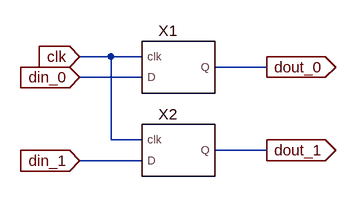
[diagram p0: schematic sram_16x2_data_dff.asc]
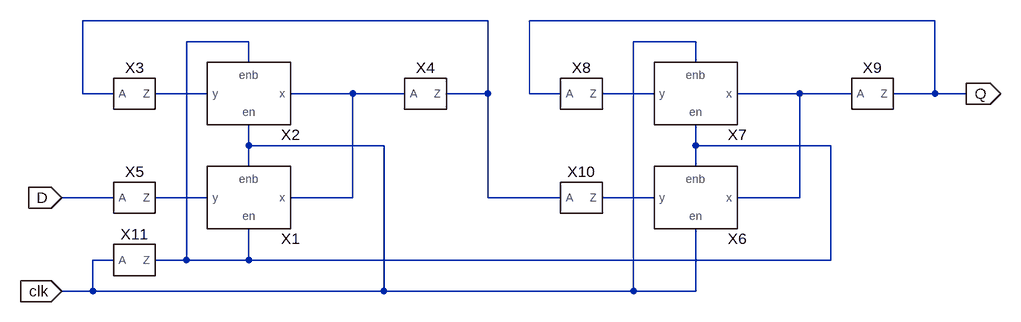
[diagram p1: sub-circuit dff.asc]
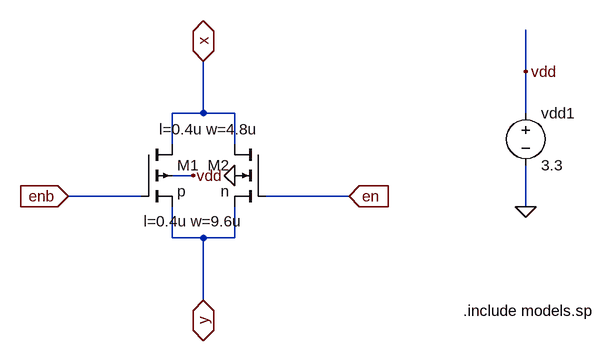
[diagram p2: sub-circuit tri_gate.asc]
sram_16x2_data_dff.asc, the LTspice schematic file:
Version 4
SHEET 1 880 680
WIRE 80 80 32 80
WIRE 128 80 80 80
WIRE 320 96 240 96
WIRE 128 112 32 112
WIRE 80 208 80 80
WIRE 128 208 80 208
WIRE 320 224 240 224
WIRE 128 240 32 240
FLAG 32 112 din_0
IOPIN 32 112 In
FLAG 32 240 din_1
IOPIN 32 240 In
FLAG 320 96 dout_0
IOPIN 320 96 Out
FLAG 320 224 dout_1
IOPIN 320 224 Out
FLAG 32 80 clk
IOPIN 32 80 In
SYMBOL dff 160 112 R0
SYMATTR InstName X1
SYMBOL dff 160 240 R0
SYMATTR InstName X2

dff.asc, the sub-circuit schematic file:
Version 4
SHEET 1 1748 1736
WIRE 16 -160 -608 -160
WIRE 704 -160 80 -160
WIRE -352 -128 -448 -128
WIRE 336 -128 240 -128
WIRE -352 -96 -352 -128
WIRE 336 -96 336 -128
WIRE -608 -48 -608 -160
WIRE -560 -48 -608 -48
WIRE -416 -48 -496 -48
WIRE -192 -48 -288 -48
WIRE -112 -48 -192 -48
WIRE 16 -48 16 -160
WIRE 16 -48 -48 -48
WIRE 80 -48 80 -160
WIRE 128 -48 80 -48
WIRE 272 -48 192 -48
WIRE 496 -48 400 -48
WIRE 576 -48 496 -48
WIRE 704 -48 704 -160
WIRE 704 -48 640 -48
WIRE 752 -48 704 -48
WIRE -352 32 -352 0
WIRE -144 32 -352 32
WIRE 336 32 336 0
WIRE 544 32 336 32
WIRE -352 64 -352 32
WIRE 336 64 336 32
WIRE -560 112 -640 112
WIRE -416 112 -496 112
WIRE -192 112 -192 -48
WIRE -192 112 -288 112
WIRE 16 112 16 -48
WIRE 128 112 16 112
WIRE 272 112 192 112
WIRE 496 112 496 -48
WIRE 496 112 400 112
WIRE -560 208 -592 208
WIRE -448 208 -448 -128
WIRE -448 208 -496 208
WIRE -352 208 -352 160
WIRE -352 208 -448 208
WIRE 544 208 544 32
WIRE 544 208 -352 208
WIRE -592 256 -592 208
WIRE -592 256 -640 256
WIRE -144 256 -144 32
WIRE -144 256 -592 256
WIRE 240 256 240 -128
WIRE 240 256 -144 256
WIRE 336 256 336 160
WIRE 336 256 240 256
FLAG -640 256 clk
IOPIN -640 256 In
FLAG -640 112 D
IOPIN -640 112 In
FLAG 752 -48 Q
IOPIN 752 -48 Out
SYMBOL tri_gate -352 112 R180
SYMATTR InstName X1
SYMBOL tri_gate -352 -48 R180
SYMATTR InstName X2
SYMBOL inv -528 -48 R0
SYMATTR InstName X3
SYMBOL inv -80 -48 R0
SYMATTR InstName X4
SYMBOL inv -528 112 R0
SYMATTR InstName X5
SYMBOL tri_gate 336 112 R180
SYMATTR InstName X6
SYMBOL tri_gate 336 -48 R180
SYMATTR InstName X7
SYMBOL inv 160 -48 R0
SYMATTR InstName X8
SYMBOL inv 608 -48 R0
SYMATTR InstName X9
SYMBOL inv 160 112 R0
SYMATTR InstName X10
SYMBOL inv -528 208 R0
SYMATTR InstName X11

tri_gate.asc, the sub-circuit schematic file:
Version 4
SHEET 1 880 680
WIRE 576 -16 576 -80
WIRE 80 48 80 -32
WIRE 80 48 32 48
WIRE 128 48 80 48
WIRE 576 48 576 -16
WIRE 32 96 32 48
WIRE 128 96 128 48
WIRE 64 144 32 144
WIRE -16 176 -128 176
WIRE 304 176 176 176
WIRE 576 192 576 128
WIRE 32 240 32 192
WIRE 80 240 32 240
WIRE 128 240 128 192
WIRE 128 240 80 240
WIRE 80 336 80 240
FLAG 128 144 0
FLAG 64 144 vdd
FLAG 576 192 0
FLAG 576 -16 vdd
FLAG 80 336 y
IOPIN 80 336 BiDir
FLAG 80 -32 x
IOPIN 80 -32 BiDir
FLAG 304 176 en
IOPIN 304 176 In
FLAG -128 176 enb
IOPIN -128 176 In
SYMBOL pmos4 -16 96 R0
WINDOW 123 4 118 Left 2
SYMATTR Value2 l=0.4u w=9.6u
SYMATTR InstName M1
SYMATTR Value p
SYMBOL nmos4 176 96 M0
WINDOW 123 12 -23 Left 2
SYMATTR Value2 l=0.4u w=4.8u
SYMATTR InstName M2
SYMATTR Value n
SYMBOL voltage 576 32 R0
WINDOW 123 0 0 Left 0
WINDOW 39 0 0 Left 0
SYMATTR InstName vdd1
SYMATTR Value 3.3
TEXT 480 352 Left 2 !.include models.sp

The netlist it stands for:
* sram_16x2_data_dff.asc
XX1 clk din_0 dout_0 dff
XX2 clk din_1 dout_1 dff

* block symbol definitions
.subckt dff clk D Q
XX1 N002 clk N004 N007 tri_gate
XX2 clk N002 N004 N003 tri_gate
XX3 N001 N003 inv  ; pins A Z
XX4 N004 N001 inv  ; pins A Z
XX5 D N007 inv  ; pins A Z
XX6 clk N002 N006 N008 tri_gate
XX7 N002 clk N006 N005 tri_gate
XX8 Q N005 inv  ; pins A Z
XX9 N006 Q inv  ; pins A Z
XX10 N001 N008 inv  ; pins A Z
XX11 clk N002 inv  ; pins A Z
.ends dff

.subckt tri_gate en enb x y
M1 x enb y vdd p l=0.4u w=9.6u
M2 x en y 0 n l=0.4u w=4.8u
vdd1 vdd 0 3.3
.include models.sp
.ends tri_gate

.model NMOS NMOS
.model PMOS PMOS
.lib standard.mos
.backanno
.end